# Altium schematic sheet ADC-Front.SchDoc: ADC Frontend
size Legal; CheckedBy: J. Brinton; CompanyName: Signal Laboratories, Inc.; DrawnBy: J. Brinton; Engineer: J. Brinton; Address1: 3479 Edison Way; Address2: Menlo Park CA 94025; Address3: +1 (877) 778-8435; Address4: siglabs.com; DocumentNumber: 49; Revision: 2b; SheetNumber: 50; SheetTotal: 58
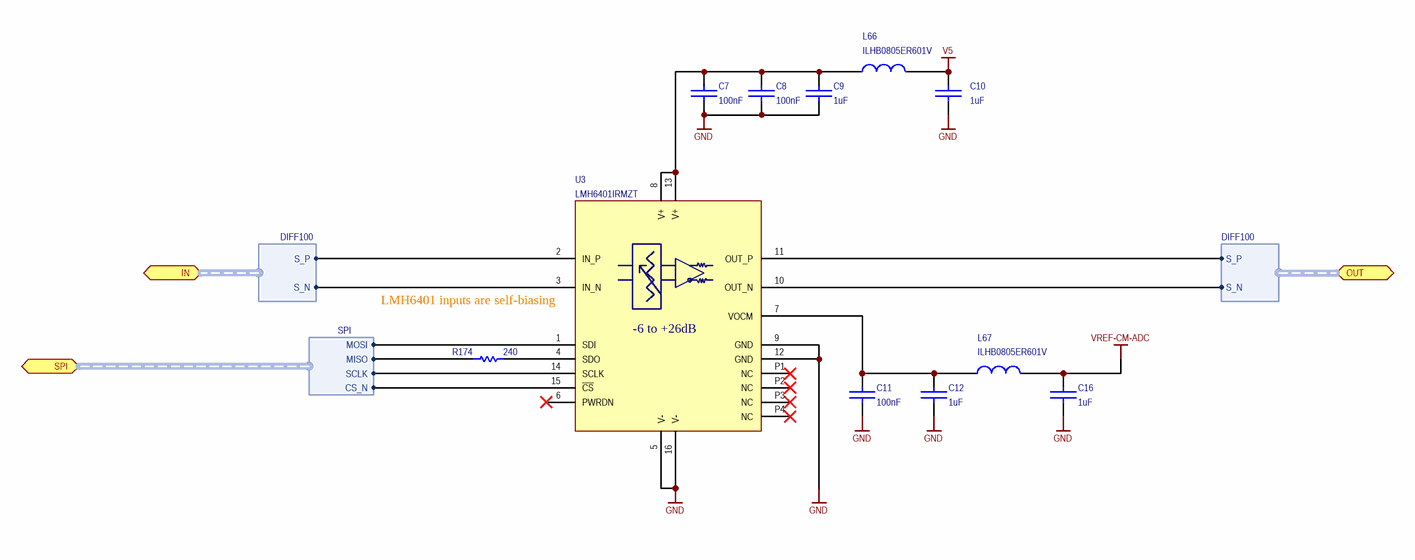
[diagram p0: ADC-Front.SchDoc]

## Parts
C7  value 100nF  [0402]  (hidden comment: GRM155R71C104KA88J)
C8  value 100nF  [0402]  (hidden comment: GRM155R71C104KA88J)
C9  value 1uF  [0402]  (hidden comment: GRM155R61A105KE15D)
C10  value 1uF  [0402]  (hidden comment: GRM155R61A105KE15D)
C11  value 100nF  [0402]  (hidden comment: GRM155R71C104KA88J)
C12  value 1uF  [0402]  (hidden comment: GRM155R61A105KE15D)
C16  value 1uF  [0402]  (hidden comment: GRM155R61A105KE15D)
L66  ILHB0805ER601V  [0805]
L67  ILHB0805ER601V  [0805]
R174  value 240  [0402]  (hidden comment: ERJ-2RKF2400X)
U3  LMH6401IRMZT  [RMZ-UQFN-16]

## Ports
IN (harness DIFF100), OUT (harness DIFF100), SPI (harness SPI)

## Harnesses
SPI: MOSI, MISO, SCLK, CS_N
DIFF100: S_P, S_N

## Nets
GND: C7.1 C8.1 C9.1 C10.1 C11.1 C12.1 C16.1 U3.5(V-) U3.9(GND) U3.12(GND) U3.16(V-)
V5: C10.2 L66.2
VREF-CM-ADC: C16.2 L67.2
NetC7_2: C7.2 C8.2 C9.2 L66.1 U3.8(V+) U3.13(V+)
NetC11_2: C11.2 C12.2 L67.1 U3.7(VOCM)
NetR174_1: R174.1 ; port SPI.MISO
NetR174_2: R174.2 U3.4(SDO)
NetU3_1: U3.1(SDI) ; port SPI.MOSI
NetU3_2: U3.2(IN_P) ; port IN.S_P
NetU3_3: U3.3(IN_N) ; port IN.S_N
NetU3_10: U3.10(OUT_N) ; port OUT.S_N
NetU3_11: U3.11(OUT_P) ; port OUT.S_P
NetU3_14: U3.14(SCLK) ; port SPI.SCLK
NetU3_15: U3.15(~{CS}) ; port SPI.CS_N

Not connected (* = marked no-connect by the designer): U3 6(PWRDN)* P1(NC)* P2(NC)* P3(NC)* P4(NC)*

## Notes on the sheet
- (near U3) LMH6401 inputs are self-biasing
- Title
- Engineer
- Revision
- Drawn By
- Checked By
- Date
- Sheet
- of
- (in symbol LMH6401) -6 to +26dB

## Library data of the parts
C7 C8 C11 = CAP: Ceramic Capacitor 100nF ±10% 16V X7R 0402; Manufacturer: Murata; Tr: -55:125; Manufacturer P/N: GRM155R71C104KA88J; Voltage: 16V; Package: 0402; Tolerance: ±10%
C9 C10 C12 C16 = CAP: Ceramic Capacitor 1uF ±10% 10V X5R 0402; Manufacturer: Murata; Tr: -55:125; Manufacturer P/N: GRM155R61A105KE15D; Package: 0402; Tolerance: ±10%; Voltage: 10V
L66 L67 = INDUCTANCE1: Ferrite Bead 600-Ohm @ 100MHz 2A 0805; Manufacturer: Vishay Dale; Value: 600@100MHz; Tolerance: ±25%; Tr: -55:125; Manufacturer P/N: ILHB0805ER601V; Package: 0805
R174 = RES 0402: Thick Film Resistor 240 ±1% 0402; Manufacturer: Panasonic; Tr: -55:155; Package: 0402; Manufacturer P/N: ERJ-2RKF2400X; Tolerance: ±1%
U3 = LMH6401: Fully Differential Variable Gain Amplifier, DC to 4.5GHz; Manufacturer: Texas Instruments; Manufacturer P/N: LMH6401IRMZT